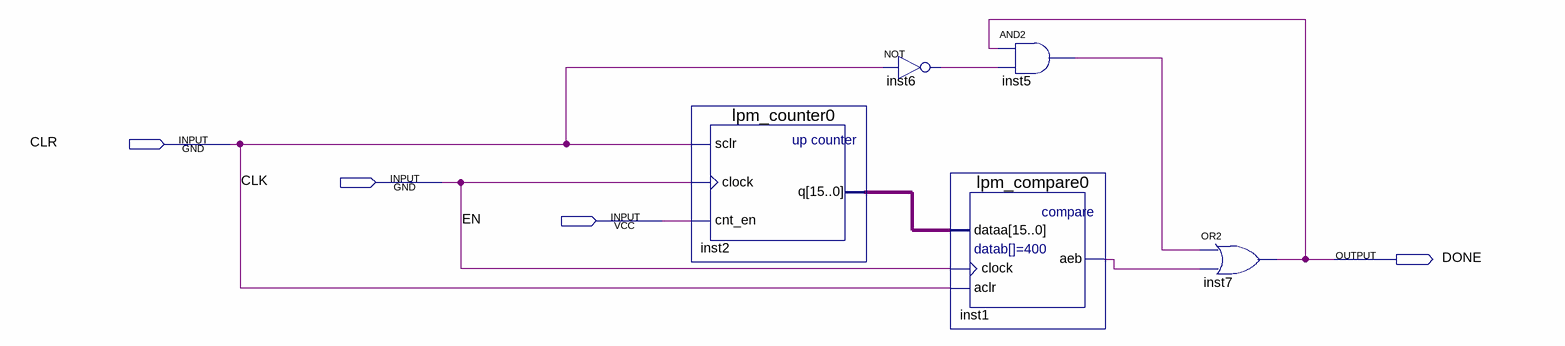
[diagram p0: schematic sheet]
// Quartus schematic CD400.bdf as structural Verilog: 5 symbols, 4 pins
module CD400 (
  input  CLR,
  input  CLK,
  input  EN,
  output DONE
);

  wire inst1_aeb, inst5_out, inst6_out;
  wire [15:0] inst2_q;

  lpm_counter0 inst2 (.sclr(CLR), .clock(CLK), .cnt_en(EN), .q(inst2_q));
  not inst6 (inst6_out, CLR);
  and inst5 (inst5_out, DONE, inst6_out);
  lpm_compare0 inst1 (.dataa(inst2_q), .clock(CLK), .aclr(CLR), .aeb(inst1_aeb));
  or inst7 (DONE, inst5_out, inst1_aeb);
endmodule
